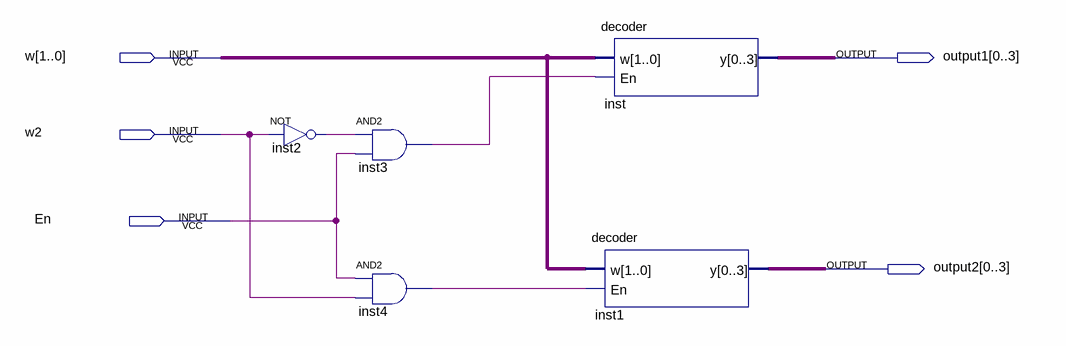
[diagram p0: schematic sheet]
// Quartus schematic 3to8decoder.bdf as structural Verilog: 5 symbols, 5 pins
module \3to8decoder  (
  input  [1:0] w,
  input  w2,
  input  En,
  output [0:3] output1,
  output [0:3] output2
);

  wire inst2_out, inst3_out, inst4_out;

  not inst2 (inst2_out, w2);
  and inst3 (inst3_out, inst2_out, En);
  and inst4 (inst4_out, En, w2);
  decoder inst (.w(w), .En(inst3_out), .y(output1));
  decoder inst1 (.w(w), .En(inst4_out), .y(output2));
endmodule
